# Altium schematic sheet CAN.SchDoc: Ixora
size A3; Organization: Toradex AG; Address1: Altsagenstrasse 5; Address2: Horw; Address3: 6048; Address4: Switzerland; DocumentNumber: 15; Revision: V1.1; SheetNumber: 15; SheetTotal: 19; PageSetup: Record=PageOptions|CenterHorizontal=True|CenterVertical=True|PrintScale=0.73|XCorrection=1.00|YCorrection=1.00|PrintKind=0|BorderSize=5000000|LeftOffset=0|BottomOffset=0|Orientation=2|PaperLength=1000|PaperWidth=1000|Scale=100|PaperSource=7|PrintQuality=-4|MediaType=1|DitherType=10|PaperKind=A4|PrintScaleMode=1
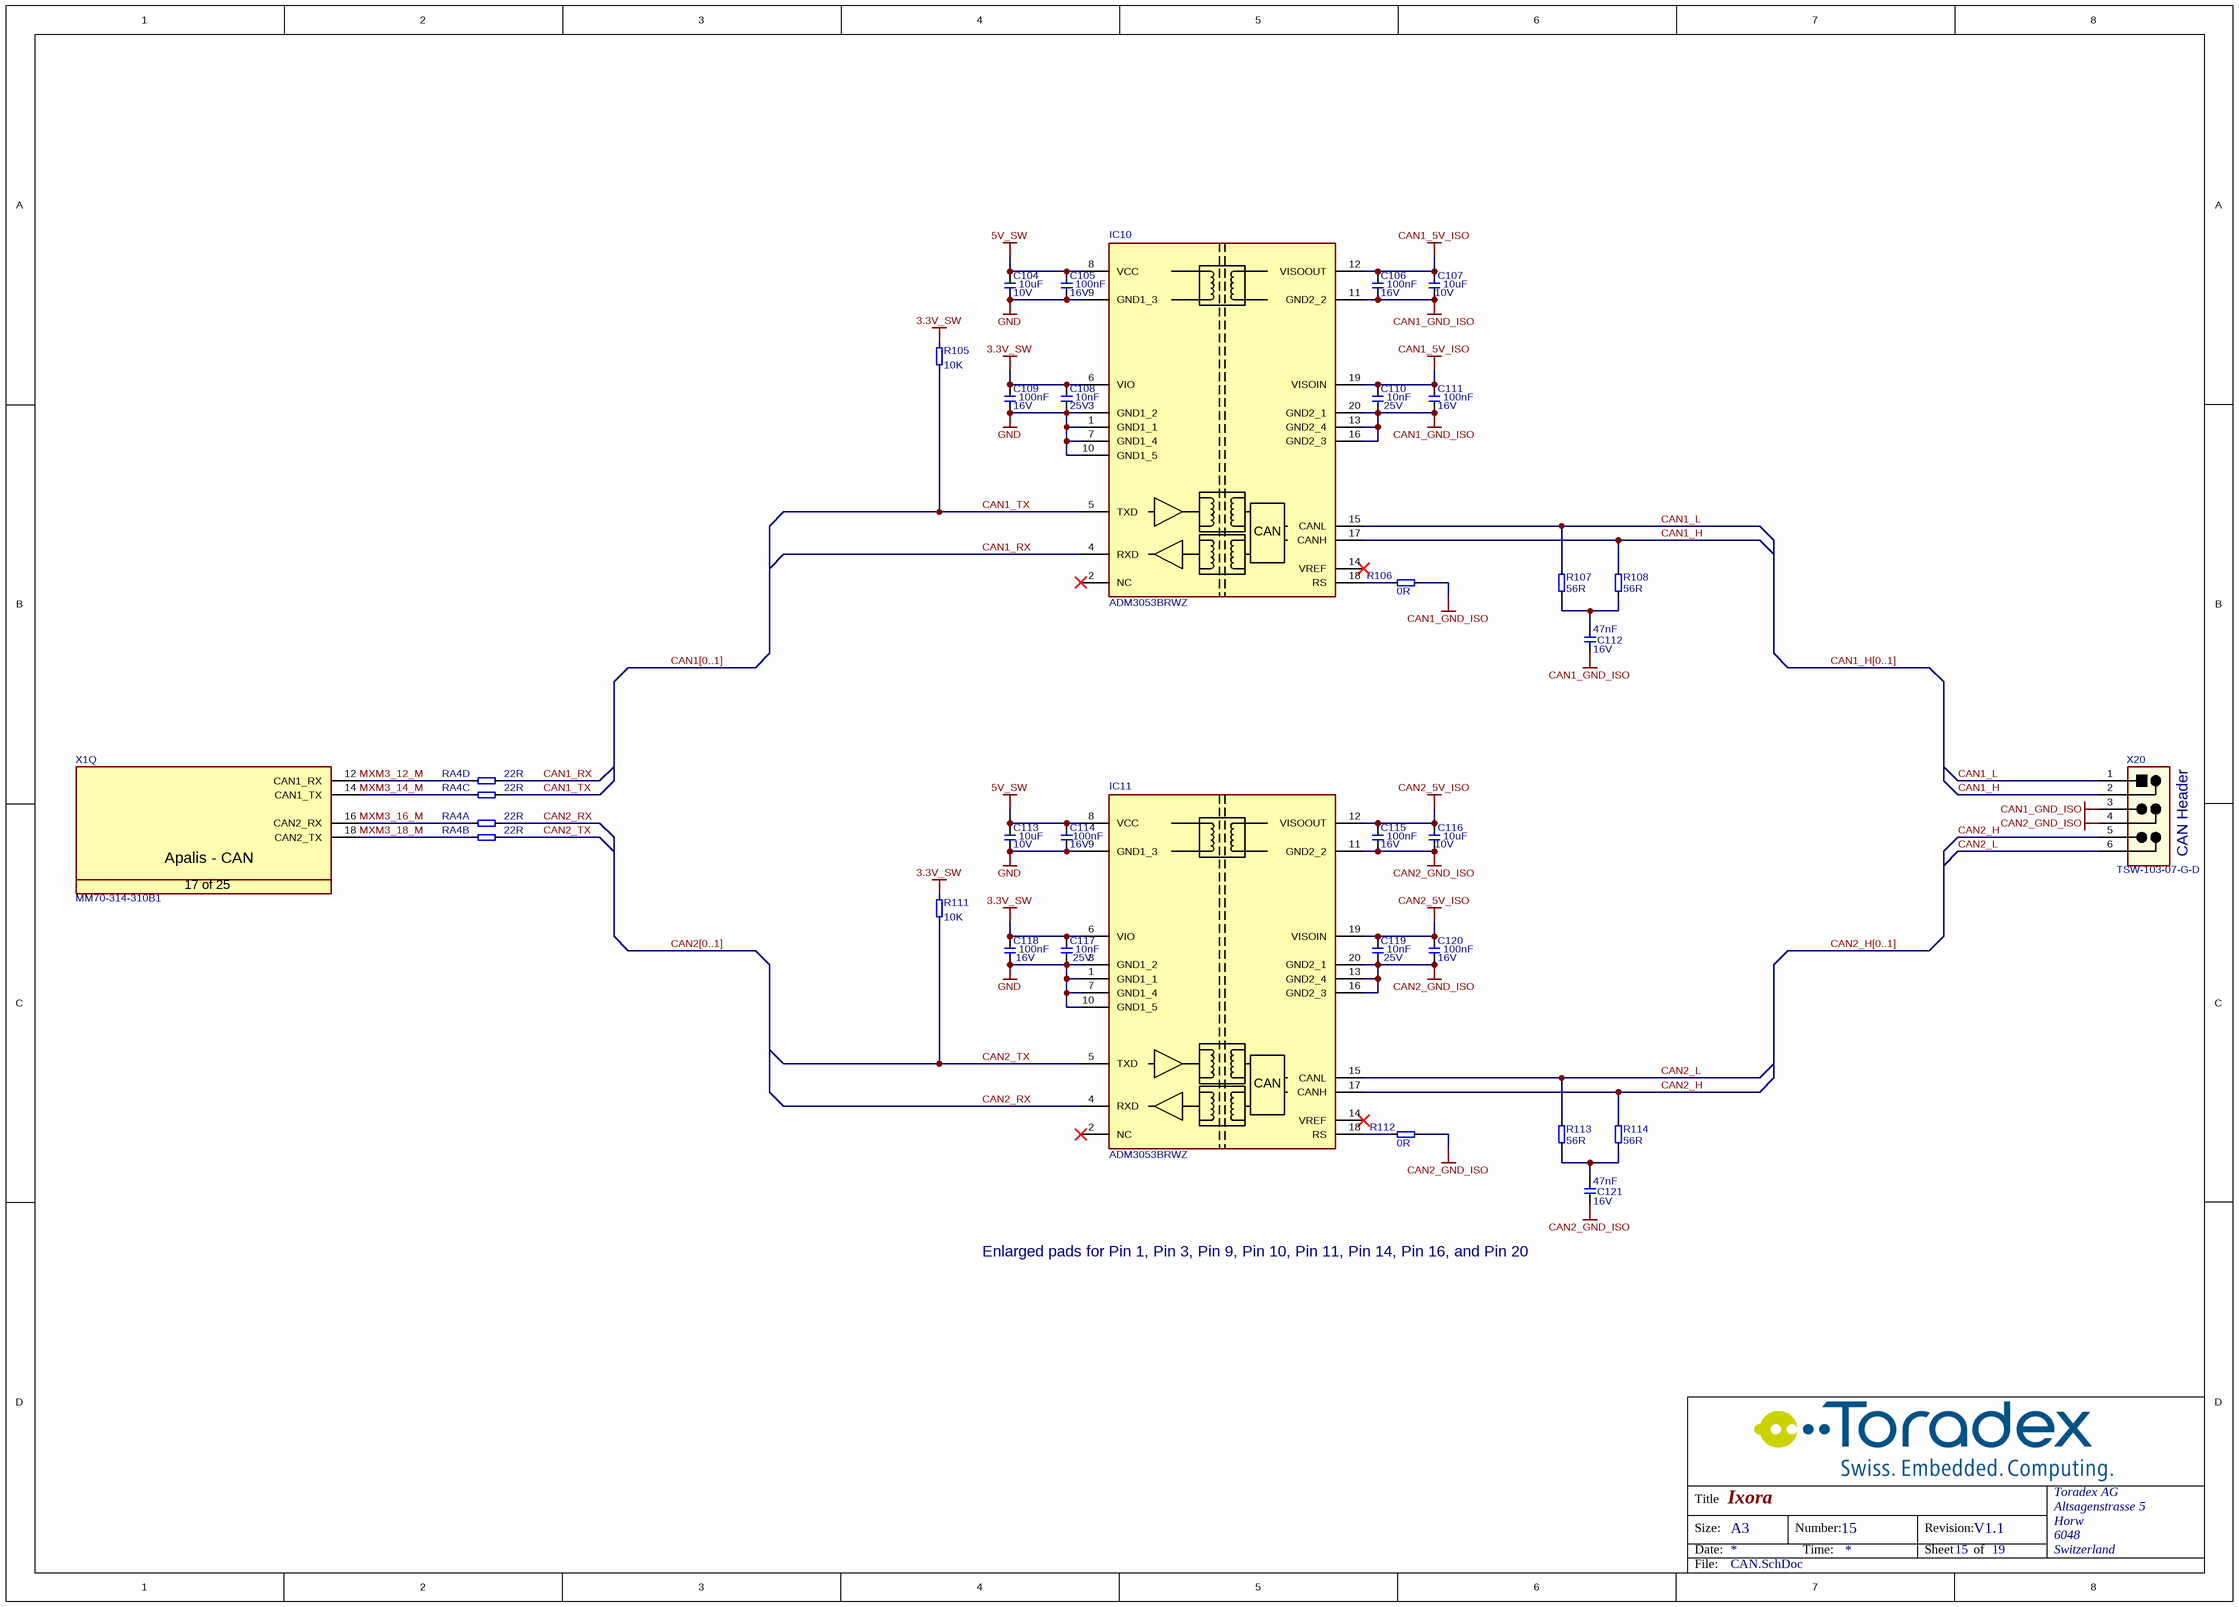
[diagram p0: CAN.SchDoc]

## Parts
C104  Rating: 10V  [T_CAPC0603X33N]  (hidden comment: 10uF)
C105  Rating: 16V  [CAPC1005X60N]  (hidden comment: 100nF)
C106  Rating: 16V  [CAPC1005X60N]  (hidden comment: 100nF)
C107  Rating: 10V  [T_CAPC0603X33N]  (hidden comment: 10uF)
C108  Rating: 25V  [CAPC1005X60N]  (hidden comment: 10nF)
C109  Rating: 16V  [CAPC1005X60N]  (hidden comment: 100nF)
C110  Rating: 25V  [CAPC1005X60N]  (hidden comment: 10nF)
C111  Rating: 16V  [CAPC1005X60N]  (hidden comment: 100nF)
C112  Rating: 16V  [T_CAPC0603X33N]  (hidden comment: 47nF)
C113  Rating: 10V  [T_CAPC0603X33N]  (hidden comment: 10uF)
C114  Rating: 16V  [CAPC1005X60N]  (hidden comment: 100nF)
C115  Rating: 16V  [CAPC1005X60N]  (hidden comment: 100nF)
C116  Rating: 10V  [T_CAPC0603X33N]  (hidden comment: 10uF)
C117  Rating: 25V  [CAPC1005X60N]  (hidden comment: 10nF)
C118  Rating: 16V  [CAPC1005X60N]  (hidden comment: 100nF)
C119  Rating: 25V  [CAPC1005X60N]  (hidden comment: 10nF)
C120  Rating: 16V  [CAPC1005X60N]  (hidden comment: 100nF)
C121  Rating: 16V  [T_CAPC0603X33N]  (hidden comment: 47nF)
IC10  ADM3053BRWZ  [T_AD_ADM3053]
IC11  ADM3053BRWZ  [T_AD_ADM3053]
R105  10K  [RESC1005X40N]
R106  0R  [RESC1005X40N]
R107  56R  [T_RESC0603X30N]
R108  56R  [T_RESC0603X30N]
R111  10K  [RESC1005X40N]
R112  0R  [RESC1005X40N]
R113  56R  [T_RESC0603X30N]
R114  56R  [T_RESC0603X30N]
RA4  22R  [T_Resistor_Array_X4]  (parts A,B,C,D of 4)
X1  Manufacturer Part No.: MM70-314-310B1  [T_JAE_MM70-314-310B1]  (hidden comment: CON-JAE-MM70-314-310B1-314-0.5mm)  (part Q of 25)
X20  TSW-103-07-G-D  [T_Samtec_TSW-103-07-G-D]

## Nets
3.3V_SW: C108.2 C109.2 C117.2 C118.2 IC10.6(VIO) IC11.6(VIO) R105.2 R111.2
5V_SW: C104.2 C105.2 C113.2 C114.2 IC10.8(VCC) IC11.8(VCC)
CAN1_5V_ISO: C106.2 C107.2 C110.2 C111.2 IC10.12(VISOOUT) IC10.19(VISOIN)
CAN1_GND_ISO: C106.1 C107.1 C110.1 C111.1 C112.1 IC10.11(GND2_2) IC10.13(GND2_4) IC10.16(GND2_3) IC10.20(GND2_1) R106.1 X20.3
CAN2_5V_ISO: C115.2 C116.2 C119.2 C120.2 IC11.12(VISOOUT) IC11.19(VISOIN)
CAN2_GND_ISO: C115.1 C116.1 C119.1 C120.1 C121.1 IC11.11(GND2_2) IC11.13(GND2_4) IC11.16(GND2_3) IC11.20(GND2_1) R112.1 X20.4
GND: C104.1 C105.1 C108.1 C109.1 C113.1 C114.1 C117.1 C118.1 IC10.1(GND1_1) IC10.3(GND1_2) IC10.7(GND1_4) IC10.9(GND1_3) IC10.10(GND1_5) IC11.1(GND1_1) IC11.3(GND1_2) IC11.7(GND1_4) IC11.9(GND1_3) IC11.10(GND1_5)
CAN1_H: IC10.17(CANH) R108.2 X20.2
CAN1_L: IC10.15(CANL) R107.2 X20.1
CAN1_RX: IC10.4(RXD) RA4.8
CAN1_TX: IC10.5(TXD) R105.1 RA4.7
CAN2_H: IC11.17(CANH) R114.2 X20.5
CAN2_L: IC11.15(CANL) R113.2 X20.6
CAN2_RX: IC11.4(RXD) RA4.5
CAN2_TX: IC11.5(TXD) R111.1 RA4.6
MXM3_12_M: RA4.4 X1.12(CAN1_RX)
MXM3_14_M: RA4.3 X1.14(CAN1_TX)
MXM3_16_M: RA4.1 X1.16(CAN2_RX)
MXM3_18_M: RA4.2 X1.18(CAN2_TX)
NetC112_2: C112.2 R107.1 R108.1
NetC121_2: C121.2 R113.1 R114.1
NetIC10_18: IC10.18(RS) R106.2
NetIC11_18: IC11.18(RS) R112.2

Not connected (* = marked no-connect by the designer): IC10 2(NC)* 14(VREF)*; IC11 2(NC)* 14(VREF)*

## Buses and harness runs
bus CAN1[0..1]
bus CAN1_H[0..1]
bus CAN2[0..1]
bus CAN2_H[0..1]

## Notes on the sheet
- (near X20) CAN Header
- (near C121) Enlarged pads for Pin 1, Pin 3, Pin 9, Pin 10, Pin 11, Pin 14, Pin 16, and Pin 20
- Title
- Size:
- Date:
- A3
- Number:
- Time:
- Revision:
- Sheet
- of
- File:
- (in symbol CON-JAE-MM70-314-310B1-314-0.5mm, part Q) Apalis - CAN; 17 of 25
- (in symbol IC-AD-ADM3053BRWZ) CAN

## Library data of the parts
C104 C107 C113 C116 = C-X5R-10uF-10V-20%-0603: Capacitor Ceramic X5R 10uF 10V 20% 0603; Tolerance: 20%; Type: X5R; Value: 10uF
C105 C106 C109 C111 C114 C115 C118 C120 = C-X7R-100nF-16V-10%-0402: Capacitor Ceramic X7R 100nF 16V 10% 0402; Tolerance: 10%; Type: X7R; Value: 100nF
C108 C110 C117 C119 = C-X7R-10nF-25V-10%-0402: Capacitor Ceramic X7R 10nF 25V 10% 0402; Tolerance: 10%; Type: X7R; Value: 10nF
C112 C121 = C-X7R-47nF-16V-10%-0603: Capacitor Ceramic X7R 47nF 16V 10% 0603; Tolerance: 10%; Type: X7R; Value: 47nF
IC10 IC11 = IC-AD-ADM3053BRWZ: Signal and Power Isolated CAN Transceiver  with Integrated Isolated DC-to-DC Converter; Manufacturer Name: Analog Devices; Manufacturer Part No.: ADM3053BRWZ
R105 R111 = R-10KR-63mW-5%-0402: Resistor 10 Kohm 63mW 5% 0402; Value: 10KR; Rating: 63mW; Tolerance: 5%
R106 R112 = R-0R-63mW-1%-0402: Resistor 0 ohm 63mW 1% 0402; Rating: 63mW; Tolerance: 1%; Value: 0R
R107 R108 R113 R114 = R-56R-63mW-5%-0603: Resistor 56 ohm 63mW 5% 0603; Rating: 63mW; Tolerance: 5%; Value: 56R
RA4 = RA-22R-63mW-5%-1206-div: Resistor Array 22 R 63mW 5% 1206; Tolerance: 5%; Power Dissipation: 63mW; Value: 22R
X1 = CON-JAE-MM70-314-310B1-314-0.5mm: MXM3 Connector; Manufacturer Name: JAE; No. of ways: 314
X20 = CON-Samtec-TSW-103-07-G-D: Header Male, 2x3 Pins, 2.54mm pitch; Manufacturer Name: Samtec; No. of. ways: 2x3; Pitch: 2.54mm; Manufacturer Part No.: TSW-103-07-G-D